# Altium project Load_HRD.PrjPcb
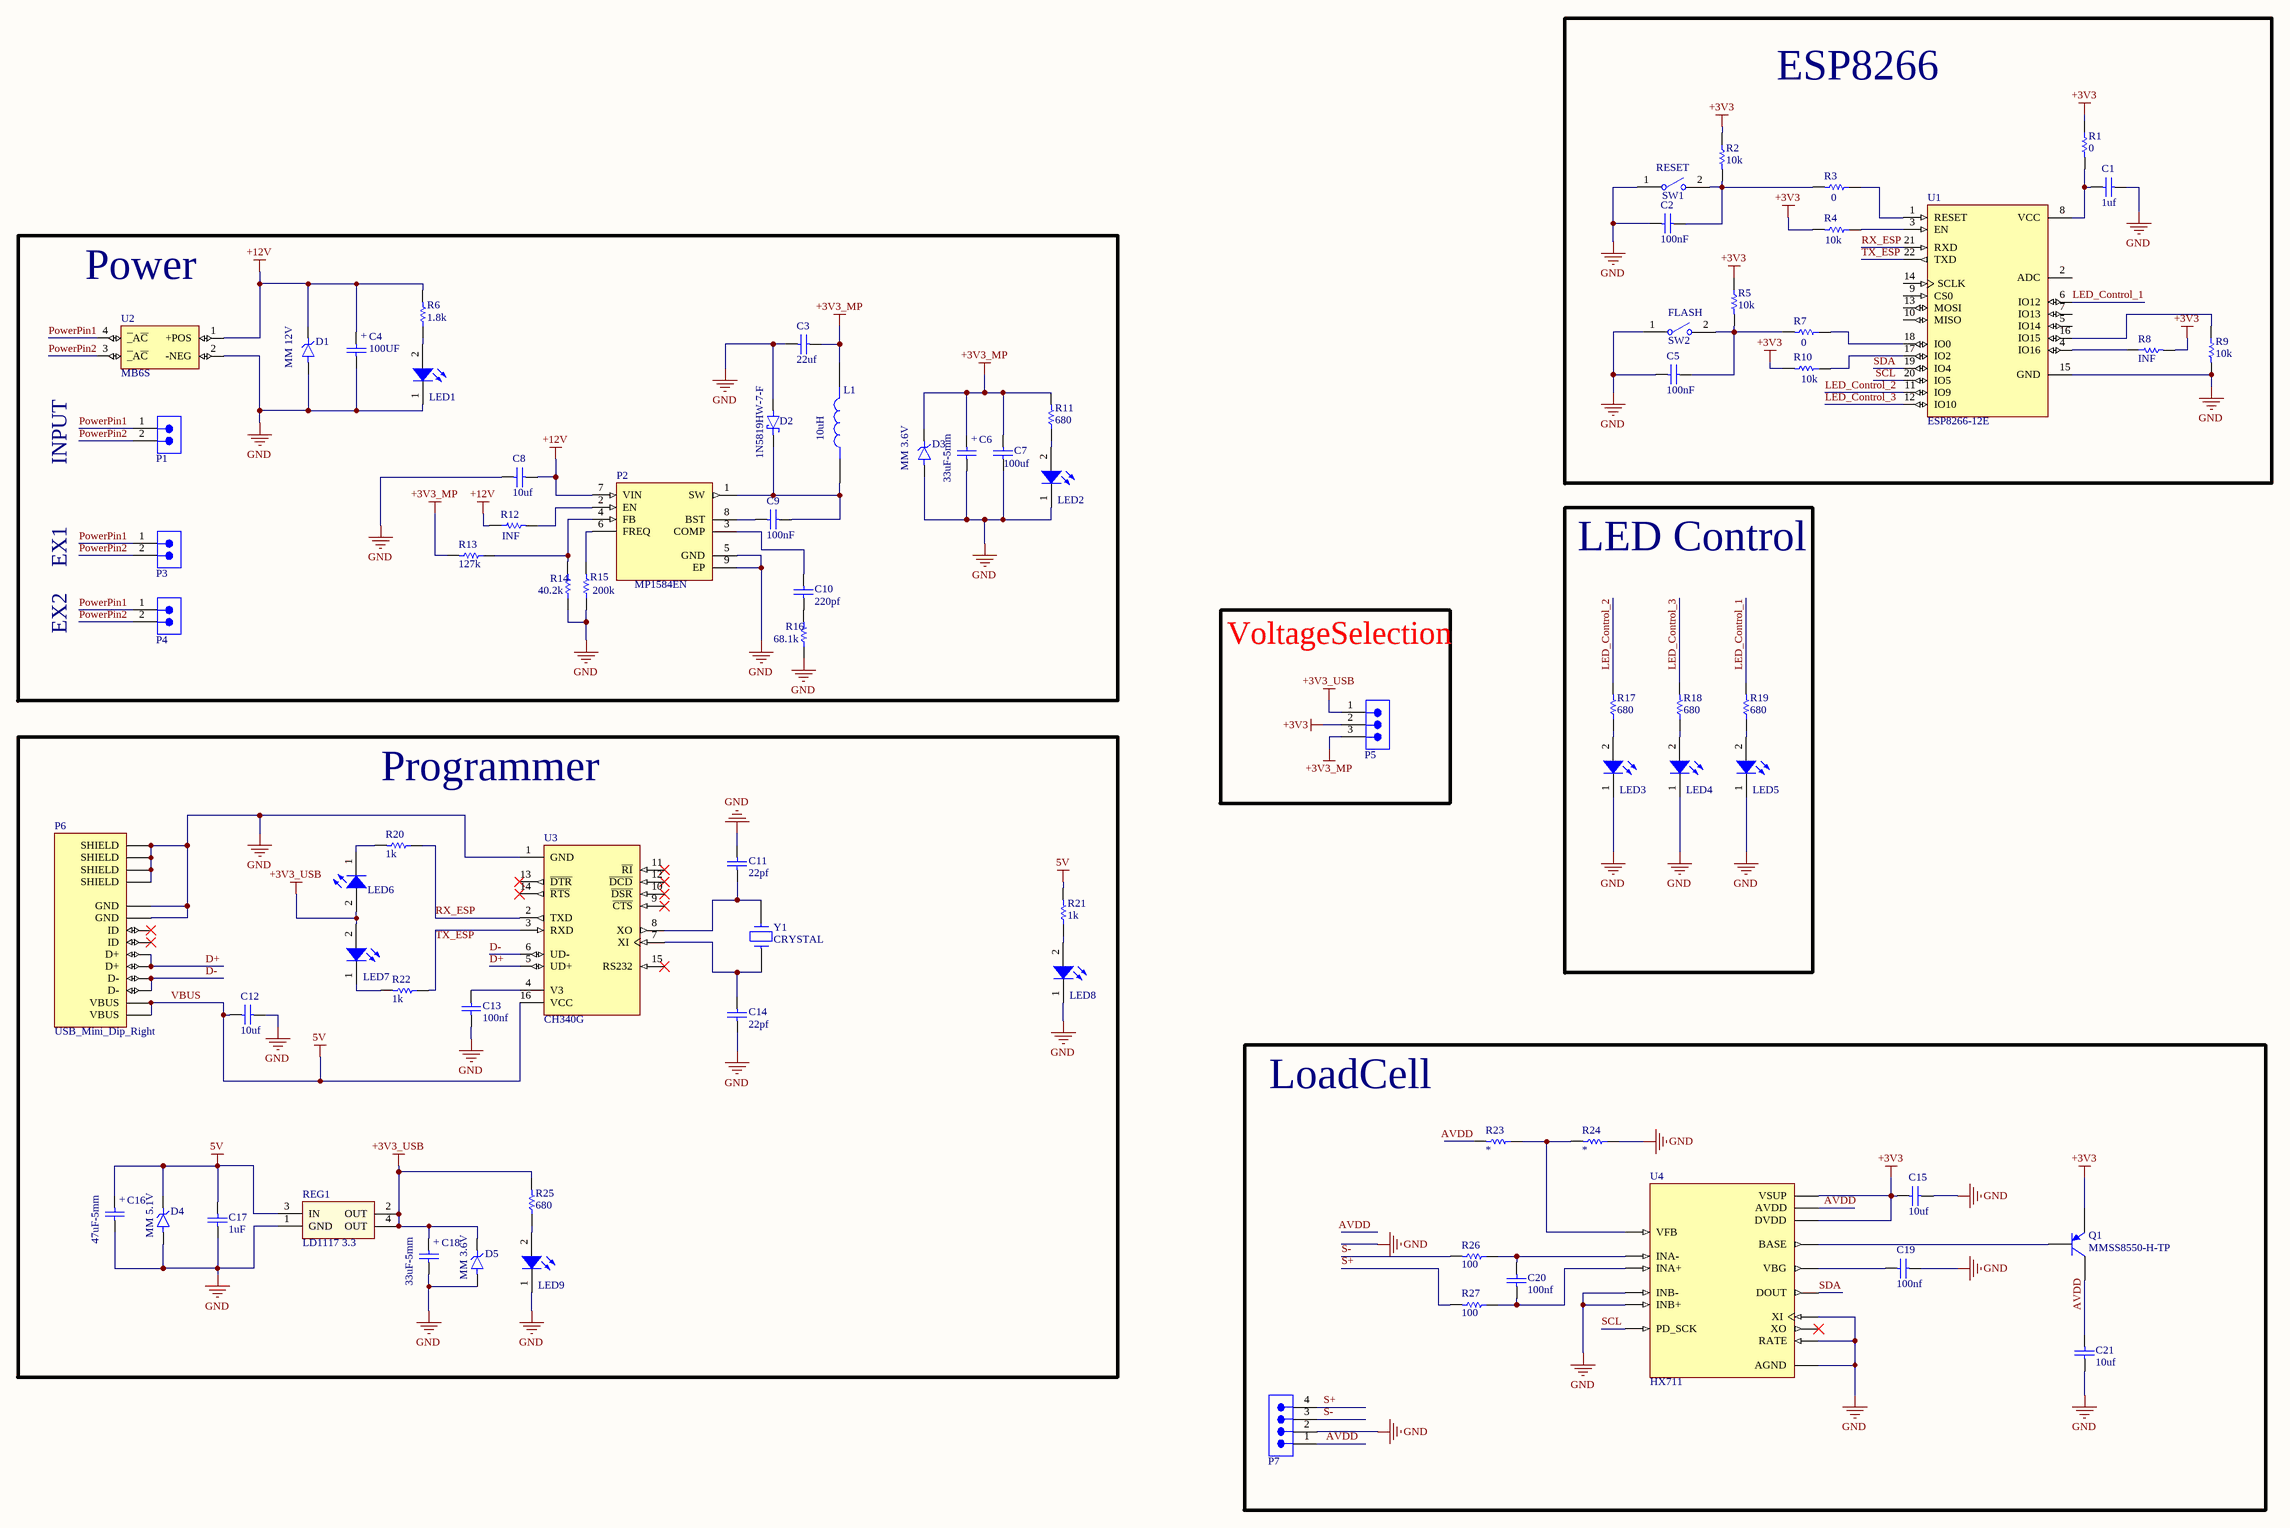
[diagram p0: Load_HRD.SchDoc]
1 sheet, 79 parts. Net scope: global (net labels, ports and power ports of the same name join across sheets).
Board file: Load_HRD.PcbDoc

## Sheet Load_HRD.SchDoc
size C; SheetNumber: 1; SheetTotal: 1

### Parts
C1  1uf  [SMD 805 CAP]
C2  100nF  [SMD 805 CAP]
C3  22uf  [SMD 805 CAP]
C4  100UF  [MY_CAP_POL 6MM]
C5  100nF  [SMD 805 CAP]
C6  33uF-5mm  [MY_CAP_POL 5MM]
C7  100uf  [SMD 805 CAP]
C8  10uf  [SMD 805 CAP]
C9  100nF  [SMD 805 CAP]
C10  220pf  [SMD 805 CAP]
C11  22pf  [SMD 805 CAP]
C12  10uf  [SMD 805 CAP]
C13  100nf  [SMD 805 CAP]
C14  22pf  [SMD 805 CAP]
C15  10uf  [SMD 805 CAP]
C16  47uF-5mm  [MY_CAP_POL 5MM]
C17  1uF  [SMD 805 CAP]
C18  33uF-5mm  [MY_CAP_POL 5MM]
C19  100nf  [SMD 805 CAP]
C20  100nf  [SMD 805 CAP]
C21  10uf  [SMD 805 CAP]
D1  MM 12V  [MiniMelf]
D2  1N5819HW-7-F  [1N5819HW-7-F]
D3  MM 3.6V  [MiniMelf]
D4  MM 5.1V  [MiniMelf]
D5  MM 3.6V  [MiniMelf]
L1  10uH  [Inductor-4*4*3]
LED1  LED_SMD_0805  [LED_0805]  (value not drawn)
LED2  LED_SMD_0805  [LED_0805]  (value not drawn)
LED3  LED_SMD_0805  [LED_0805]  (value not drawn)
LED4  LED_SMD_0805  [LED_0805]  (value not drawn)
LED5  LED_SMD_0805  [LED_0805]  (value not drawn)
LED6  LED_SMD_0805  [LED_0805]  (value not drawn)
LED7  LED_SMD_0805  [LED_0805]  (value not drawn)
LED8  LED_SMD_0805  [LED_0805]  (value not drawn)
LED9  LED_SMD_0805  [LED_0805]  (value not drawn)
P1  691312510002  [691312510002]  (value not drawn)
P2  MP1584EN  [MP1584EN]
P3  691312510002  [691312510002]  (value not drawn)
P4  691312510002  [691312510002]  (value not drawn)
P5  61300311121  [61300311121]  (value not drawn)
P6  USB_Mini_Dip_Right  [USB_MINI_Right]
P7  691312510004  [691312510004]  (value not drawn)
Q1  MMSS8550-H-TP  [MY_SMD_TRANSISTOR]
R1  0  [SMD 805]
R2  10k  [SMD 805]
R3  0  [SMD 805]
R4  10k  [SMD 805]
R5  10k  [SMD 805]
R6  1.8k  [SMD 805]
R7  0  [SMD 805]
R8  INF  [SMD 805]
R9  10k  [SMD 805]
R10  10k  [SMD 805]
R11  680  [SMD 805]
R12  INF  [SMD 805]
R13  127k  [SMD 805]
R14  40.2k  [SMD 805]
R15  200k  [SMD 805]
R16  68.1k  [SMD 805]
R17  680  [SMD 805]
R18  680  [SMD 805]
R19  680  [SMD 805]
R20  1k  [SMD 805]
R21  1k  [SMD 805]
R22  1k  [SMD 805]
R23  *  [SMD 805]
R24  *  [SMD 805]
R25  680  [SMD 805]
R26  100  [SMD 805]
R27  100  [SMD 805]
REG1  LD1117 3.3  [MY_LD1117-3.3]
SW1  434111043826  [WS-TASV_L6W3.5H4.3_4341x10438x6]  (value not drawn)
SW2  434111043826  [WS-TASV_L6W3.5H4.3_4341x10438x6]  (value not drawn)
U1  ESP8266-12E  [ESP8266]
U2  MB6S  [MB6S]
U3  CH340G  [CH340G]
U4  HX711  [HX711]
Y1  CRYSTAL  [My_Crystal]

### Blocks framed on the sheet
ESP8266: C1 C2 C5 R1-R5 R7-R10 SW1 SW2 U1
Power: C3 C4 C6-C10 D1-D3 L1 LED1 LED2 P1-P4 R6 R11-R16 U2
LED Control: LED3-LED5 R17-R19
VoltageSelection: P5
Programmer: C11-C14 C16-C18 D4 D5 LED6-LED9 P6 R20-R22 R25 REG1 U3 Y1
LoadCell: C15 C19-C21 P7 Q1 R23 R24 R26 R27 U4

### Nets
+3V3: C15.2 P5.2 Q1.E R1.1 R2.1 R4.2 R5.1 R8.2 R10.2 U4.1(VSUP) U4.16(DVDD)
+3V3_MP: C3.2 C6.+ C7.2 D3.2 L1.2 P5.3 R11.2 R13.2
+3V3_USB: C18.+ D5.2 LED6.2(A) LED7.2(A) P5.1 R25.2 REG1.2(OUT) REG1.4(OUT)
+12V: C4.+ C8.2 D1.2 P2.7(VIN) R6.2 R12.1 U2.1(+POS)
GND: C1.2 C2.2 C3.1 C4.- C5.2 C6.- C7.1 C8.1 C11.2 C12.2 C13.1 C14.1 C15.1 C16.- C17.1 C18.- C19.1 C21.2 D1.1 D2.A D3.1 D4.1 D5.1 LED1.1(K) LED2.1(K) LED3.1(K) LED4.1(K) LED5.1(K) LED8.1(K) LED9.1(K) P2.5(GND) P2.9(EP) P6.5(GND) P6.10(GND) P6.11(SHIELD) P6.12(SHIELD) P6.S1(SHIELD) P6.S2(SHIELD) P7.2 R9.2 R14.1 R15.1 R16.1 R24.1 REG1.1(GND) SW1.1 SW2.1 U1.15(GND) U2.2(-NEG) U3.1(GND) U4.5(AGND) U4.9(INB-) U4.10(INB+) U4.14(XI) U4.15(RATE)
VBUS: C12.1 C16.+ C17.2 D4.2 P6.1(VBUS) P6.6(VBUS) R21.2 REG1.3(IN) U3.16(VCC)  [also labelled 5V]
AVDD: C21.1 P7.1 Q1.C R23.2 U4.3(AVDD)
D+: P6.3(D+) P6.8(D+) U3.5(UD+)
D-: P6.2(D-) P6.7(D-) U3.6(UD-)
LED_Control_1: R19.2 U1.6(IO12)
LED_Control_2: R17.2 U1.11(IO9)
LED_Control_3: R18.2 U1.12(IO10)
PowerPin1: P1.1 P3.1 P4.1 U2.4(~{_}A~{C})
PowerPin2: P1.2 P3.2 P4.2 U2.3(~{_}A~{C})
RX_ESP: R20.1 U1.21(RXD) U3.2(TXD)
S+: P7.4 R27.2
S-: P7.3 R26.2
SCL: U1.20(IO5) U4.11(PD_SCK)
SDA: U1.19(IO4) U4.12(DOUT)
TX_ESP: R22.1 U1.22(TXD) U3.3(RXD)
NetC1_1: C1.1 R1.2 U1.8(VCC)
NetC2_1: C2.1 R2.2 R3.2 SW1.2
NetC5_1: C5.1 R5.2 R7.2 SW2.2
NetC9_1: C9.1 P2.8(BST)
NetC9_2: C9.2 D2.C(K) L1.1 P2.1(SW)
NetC10_1: C10.1 P2.3(COMP)
NetC10_2: C10.2 R16.2
NetC11_1: C11.1 U3.8(XO) Y1.2
NetC13_2: C13.2 U3.4(V3)
NetC14_2: C14.2 U3.7(XI) Y1.1
NetC19_2: C19.2 U4.6(VBG)
NetC20_1: C20.1 R27.1 U4.8(INA+)
NetC20_2: C20.2 R26.1 U4.7(INA-)
NetLED1_2: LED1.2(A) R6.1
NetLED2_2: LED2.2(A) R11.1
NetLED3_2: LED3.2(A) R17.1
NetLED4_2: LED4.2(A) R18.1
NetLED5_2: LED5.2(A) R19.1
NetLED6_1: LED6.1(K) R20.2
NetLED7_1: LED7.1(K) R22.2
NetLED8_2: LED8.2(A) R21.1
NetLED9_2: LED9.2(A) R25.1
NetP2_2: P2.2(EN) R12.2
NetP2_4: P2.4(FB) R13.1 R14.2
NetP2_6: P2.6(FREQ) R15.2
NetQ1_B: Q1.B U4.2(BASE)
NetR3_1: R3.1 U1.1(RESET)
NetR4_1: R4.1 U1.3(EN)
NetR7_1: R7.1 U1.18(IO0)
NetR8_1: R8.1 U1.4(IO16)
NetR9_1: R9.1 U1.16(IO15)
NetR10_1: R10.1 U1.17(IO2)
NetR23_1: R23.1 R24.2 U4.4(VFB)

Not connected (* = marked no-connect by the designer): P6 4(ID)* 9(ID)*; U1 2(ADC) 5(IO14) 7(IO13) 9(CS0) 10(MISO) 13(MOSI) 14(SCLK); U3 9(~{CTS})* 10(~{DSR})* 11(~{RI})* 12(~{DCD})* 13(~{DTR})* 14(~{RTS})* 15(RS232)*; U4 13(XO)*

### Notes on the sheet
- (near SW1) RESET
- (near SW2) FLASH
- INPUT
- EX1
- EX2

### Library data of the parts
C1 C2 C5 C9 C17 = CAP B
C3 C7 C8 C10-C15 C19-C21 = CAP B: 1uf
C4 = Cap Pol_6mm: CAP-3300Uf
C6 C16 C18 = Cap Pol_5mm: CAP-3300Uf; Value: 3300u
D1 D3-D5 = MiniMelf_500mW: MP: ZM4736A_L0; Package: None; Availability: Unavailable; Price: None; Value: *
L1 = Inductor4*4*3
P1 P3 P4 = 691312510002: WR-TBL Series 312 Open Horizontal PCB Header, THT, pitch 5.08mm, 2p; Manufacturer: Wurth Elektronik; Modularity: No; Rated Current: 20A; Working Voltage: 300V; ComponentLink1Description: Website Link; ComponentLink1URL: https://www.we-online.com/redexpert/article/691312510002?ad; ComponentLink2Description: Datasheet Link; ComponentLink2URL: https://www.we-online.com/redexpert/spec/691312510002?ad; Manufacturer Part Number: 691312510002; Category: Terminal Blocks; Match Code: WR-TBL; Mount: Through Hole; Operating Temperature Max: 105°C; Operating Temperature Min: -40°C; Packaging: Box; Application: Pluggable; Number of Pins: 2; Number of Rows: 1; Orientation: Horizontal; Pitch: 5.08mm
P5 = 61300311121: WR-PHD Pin Header, THT, Vertical, pitch 2.54mm, 1 Row, 3P; Manufacturer: Wurth Elektronik; Contact Resistance: 20mΩ; Rated Current: 3A; Working Voltage: 250V; Withstanding Voltage: 500V; ComponentLink1Description: Website Link; ComponentLink1URL: https://www.we-online.com/redexpert/article/61300311121?ad; ComponentLink2Description: Datasheet Link; ComponentLink2URL: https://www.we-online.com/redexpert/spec/61300311121?ad; Manufacturer Part Number: 61300311121; Category: Board-to-Board Connectors; Match Code: WR-PHD; Mount: Through Hole; Operating Temperature Max: 105°C; Operating Temperature Min: -40°C; Packaging: Bag; Gender: Pin Header; Number of Pins: 3; Number of Rows: 1; Orientation: Vertical; Pitch: 2.54mm
P7 = 691312510004: WR-TBL Series 312 Open Horizontal PCB Header, THT, pitch 5.08mm, 4p; Manufacturer: Wurth Elektronik; Modularity: No; Rated Current: 20A; Working Voltage: 300V; ComponentLink1Description: Website Link; ComponentLink1URL: https://www.we-online.com/redexpert/article/691312510004?ad; ComponentLink2Description: Datasheet Link; ComponentLink2URL: https://www.we-online.com/redexpert/spec/691312510004?ad; Manufacturer Part Number: 691312510004; Category: Terminal Blocks; Match Code: WR-TBL; Mount: Through Hole; Operating Temperature Max: 105°C; Operating Temperature Min: -40°C; Packaging: Box; Application: Pluggable; Number of Pins: 4; Number of Rows: 1; Orientation: Horizontal; Pitch: 5.08mm
Q1 = 3906 SMD TRANSISTOR: PNP 60V 625mW IC=200mA
R1-R27 = Resistor
SW1 SW2 = 434111043826: WS-TASV SMT Tact Switch, L6 x W3.5 x H4.3mm, 260g, SPST-NO, 12V, 50mA; Manufacturer: Wurth Elektronik; Washable: No; Manufacturer Part Number: 434111043826; Category: Tact Switches; Match Code: WS-TASV; ComponentLink1Description: Website Link; ComponentLink1URL: https://www.we-online.com/redexpert/article/434111043826?ad; ComponentLink2Description: Datasheet Link; ComponentLink2URL: https://www.we-online.com/redexpert/spec/434111043826?ad; Mount: Surface Mount; Operating Temperature Max: 85°C; Operating Temperature Min: -40°C; Packaging: Tape and Reel; Length: 6mm; Width: 3.5mm; Height: 4.3mm; Circuit: SPST-NO; Contact Material: Stainless Steel; Contact Plating: Silver; Operation Force: 260g; Rated Current: 50mA; Rated Voltage (DC): 12V; Terminal Material: Copper Alloy; Terminal Plating: Silver